# Altium schematic sheet BEESP_CODE_mcu.SchDoc
size A4
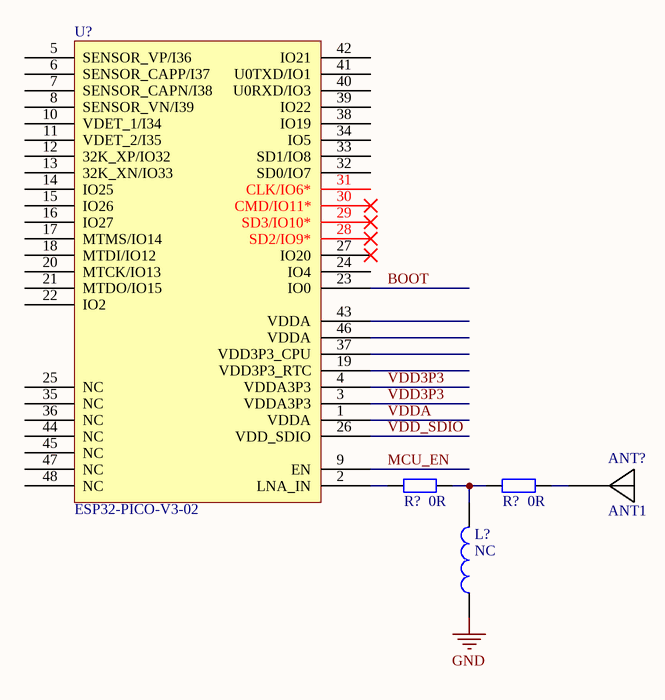
[diagram p0: BEESP_CODE_mcu.SchDoc]

## Parts
(Parts that share a designator on the sheet are numbered #1, #2 ... from top to bottom, then left to right.)
ANT?  ANT1  [2.4GANTF0]
L?  NC  [L 0603]
R?#1  0R  [R 0603_L]
R?#2  0R  [R 0603_L]
U?  ESP32-PICO-V3-02  [QFN48 7X7_N]

## Nets
GND: L?.1
BOOT: U?.23(IO0)
MCU_EN: U?.9(EN)
VDD3P3: U?.3(VDDA3P3) U?.4(VDDA3P3)
VDD_SDIO: U?.26(VDD_SDIO)
VDDA: U?.1(VDDA)
NetANT?_1: ANT?.1 R?#2.2
NetL?_2: L?.2 R?#1.2 R?#2.1
NetR?#1_1: R?#1.1 U?.2(LNA_IN)

Not connected (* = marked no-connect by the designer): U? 5(SENSOR_VP/I36) 6(SENSOR_CAPP/I37) 7(SENSOR_CAPN/I38) 8(SENSOR_VN/I39) 10(VDET_1/I34) 11(VDET_2/I35) 12(32K_XP/IO32) 13(32K_XN/IO33) 14(IO25) 15(IO26) 16(IO27) 17(MTMS/IO14) 18(MTDI/IO12) 19(VDD3P3_RTC) 20(MTCK/IO13) 21(MTDO/IO15) 22(IO2) 24(IO4) 25(NC) 27(IO20)* 28(SD2/IO9*)* 29(SD3/IO10*)* 30(CMD/IO11*)* 31(CLK/IO6*) 32(SD0/IO7) 33(SD1/IO8) 34(IO5) 35(NC) 36(NC) 37(VDD3P3_CPU) 38(IO19) 39(IO22) 40(U0RXD/IO3) 41(U0TXD/IO1) 42(IO21) 43(VDDA) 44(NC) 45(NC) 46(VDDA) 47(NC) 48(NC)

## Library data of the parts
ANT? = ANT1: PCB板载天线; 版权归属: 封装库来自淘宝 ID：黄晶宝石; BOM名称: PCB板载天线; 技术支持，联系售后: https://shop463601444.taobao.com
L? = L: 小功率贴片电感; 优秀评价可免费更新: 联系淘宝ID：黄晶宝石，获取更新版封装库; 卖家免费技术支持，联系售后: 唯一出售店铺网址https://shop463601444.taobao.com; 本封装库来自淘宝卖家 ID：黄晶宝石: 其他店铺购入均为盗版，请立即申请退款; BOM名称: 小功率贴片电感
R?#1 R?#2 = R: 贴片电阻; 优秀评价可免费更新: 联系淘宝ID：黄晶宝石，获取更新版封装库; 卖家免费技术支持，联系售后: 唯一出售店铺网址https://shop463601444.taobao.com; 本封装库来自淘宝卖家 ID：黄晶宝石: 其他店铺购入均为盗版，请立即申请退款; BOM名称: 贴片电阻